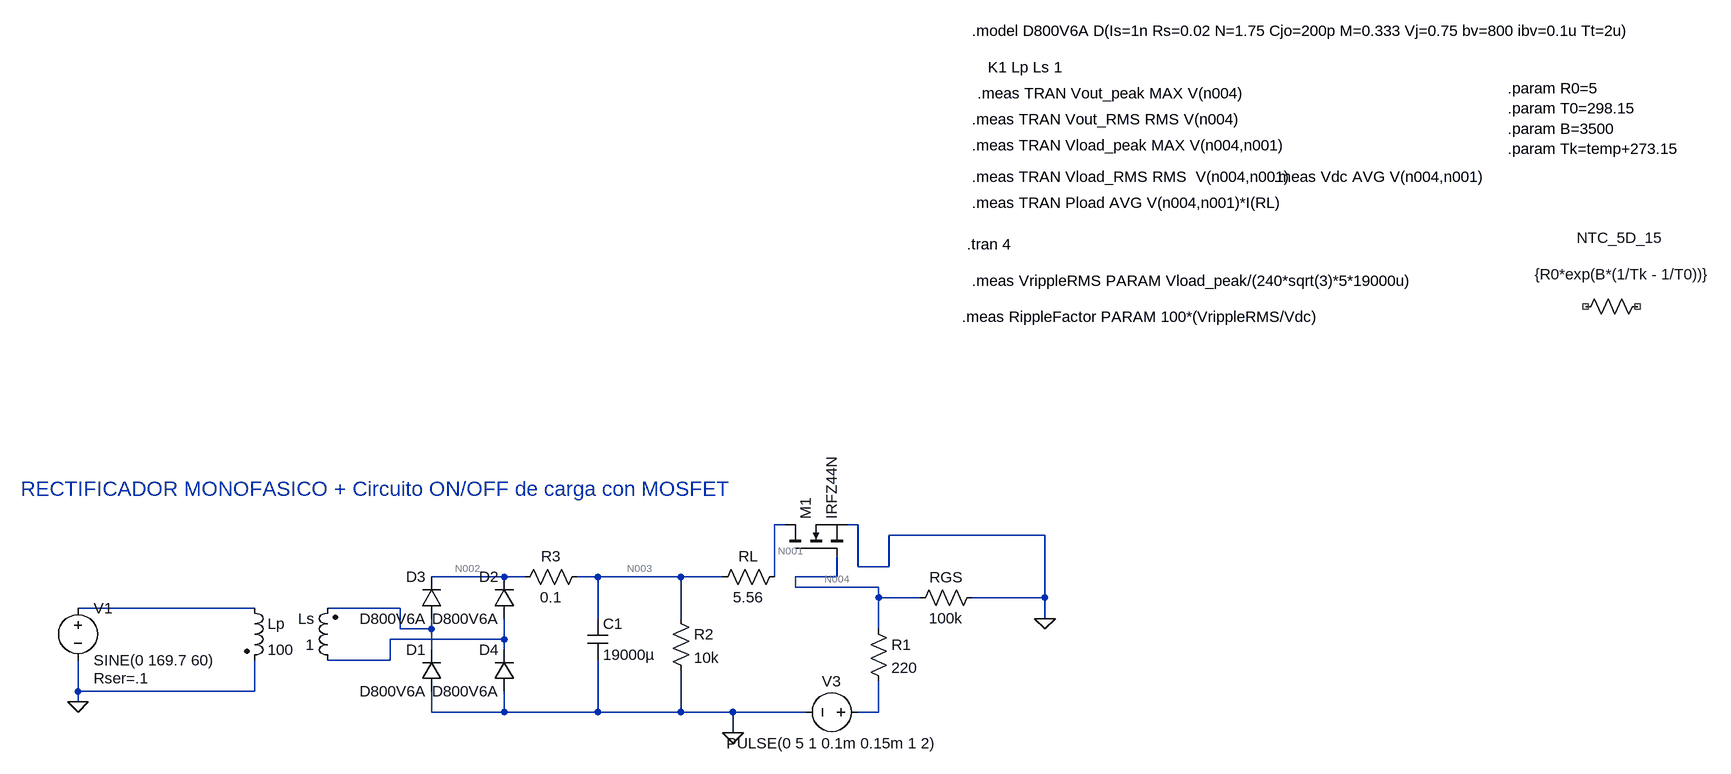
[diagram p0: schematic MOSFET Simulation.asc]
MOSFET Simulation.asc, the LTspice schematic file:
Version 4.1
SHEET 1 2096 824
WIRE 432 0 416 0
WIRE 544 0 528 0
WIRE 832 16 592 16
WIRE 544 64 544 0
WIRE 592 64 592 16
WIRE 592 64 544 64
WIRE 0 80 -112 80
WIRE 32 80 0 80
WIRE 144 80 112 80
WIRE 272 80 144 80
WIRE 336 80 272 80
WIRE 416 80 416 0
WIRE 512 80 512 48
WIRE 512 80 448 80
WIRE 448 96 448 80
WIRE 576 96 448 96
WIRE 576 112 576 96
WIRE 640 112 576 112
WIRE 832 112 832 16
WIRE 832 112 720 112
WIRE -384 128 -656 128
WIRE -160 128 -272 128
WIRE 144 144 144 80
WIRE 272 144 272 80
WIRE 832 144 832 112
WIRE -160 160 -160 128
WIRE -112 160 -112 144
WIRE -112 160 -160 160
WIRE 576 160 576 112
WIRE 0 176 0 144
WIRE 0 176 -176 176
WIRE -112 192 -112 160
WIRE 0 192 0 176
WIRE -176 208 -176 176
WIRE -176 208 -272 208
WIRE -656 256 -656 208
WIRE -384 256 -384 208
WIRE -384 256 -656 256
WIRE -656 272 -656 256
WIRE -112 288 -112 256
WIRE 0 288 0 256
WIRE 0 288 -112 288
WIRE 144 288 144 208
WIRE 144 288 0 288
WIRE 272 288 272 224
WIRE 272 288 144 288
WIRE 352 288 272 288
WIRE 464 288 352 288
WIRE 576 288 576 240
WIRE 576 288 544 288
WIRE 352 320 352 288
FLAG 352 320 0
FLAG -656 272 0
FLAG 832 144 0
SYMBOL diode -96 256 R180
WINDOW 0 24 64 Left 2
WINDOW 3 24 0 Left 2
SYMATTR InstName D1
SYMATTR Value D800V6A
SYMBOL diode 16 144 R180
WINDOW 0 24 64 Left 2
WINDOW 3 24 0 Left 2
SYMATTR InstName D2
SYMATTR Value D800V6A
SYMBOL diode -96 144 R180
WINDOW 0 24 64 Left 2
WINDOW 3 24 0 Left 2
SYMATTR InstName D3
SYMATTR Value D800V6A
SYMBOL diode 16 256 R180
WINDOW 0 24 64 Left 2
WINDOW 3 24 0 Left 2
SYMATTR InstName D4
SYMATTR Value D800V6A
SYMBOL voltage -656 112 R0
WINDOW 123 0 0 Left 0
WINDOW 39 24 124 Left 2
SYMATTR SpiceLine Rser=.1
SYMATTR InstName V1
SYMATTR Value SINE(0 169.7 60)
SYMBOL ind2 -400 112 R0
SYMATTR InstName Lp
SYMATTR Value 100
SYMBOL ind2 -256 224 R180
WINDOW 0 36 80 Left 2
WINDOW 3 36 40 Left 2
SYMATTR InstName Ls
SYMATTR Value 1
SYMBOL res 1760 -352 R90
WINDOW 0 -74 42 VBottom 2
WINDOW 3 -18 39 VBottom 2
SYMATTR InstName NTC_5D_15
SYMATTR Value {R0*exp(B*(1/Tk - 1/T0))}
SYMBOL res 256 128 R0
SYMATTR InstName R2
SYMATTR Value 10k
SYMBOL res 320 96 R270
WINDOW 0 32 56 VTop 2
WINDOW 3 0 56 VBottom 2
SYMATTR InstName RL
SYMATTR Value 5.56
SYMBOL voltage 560 288 R90
WINDOW 0 -32 56 VBottom 2
WINDOW 3 32 56 VTop 2
WINDOW 123 0 0 Left 0
WINDOW 39 0 0 Left 0
SYMATTR InstName V3
SYMATTR Value PULSE(0 5 1 0.1m 0.15m 1 2)
SYMBOL res 736 96 R90
WINDOW 0 0 56 VBottom 2
WINDOW 3 32 56 VTop 2
SYMATTR InstName RGS
SYMATTR Value 100k
SYMBOL res 560 144 R0
SYMATTR InstName R1
SYMATTR Value 220
SYMBOL nmos 432 48 R270
SYMATTR InstName M1
SYMATTR Value IRFZ44N
SYMBOL res 128 64 R90
WINDOW 0 0 56 VBottom 2
WINDOW 3 32 56 VTop 2
SYMATTR InstName R3
SYMATTR Value 0.1
SYMBOL cap 128 144 R0
SYMATTR Value 19000µ
SYMATTR InstName C1
SYMATTR SpiceLine V=16 Irms=1.39 Rser=0.044 Lser=0
TEXT 712 -432 Left 2 !.tran 4
TEXT -744 -56 Left 3 ;RECTIFICADOR MONOFASICO + Circuito ON/OFF de carga con MOSFET
TEXT 720 -760 Left 2 !.model D800V6A D(Is=1n Rs=0.02 N=1.75 Cjo=200p M=0.333 Vj=0.75 bv=800 ibv=0.1u Tt=2u)
TEXT 744 -704 Left 2 !K1 Lp Ls 1
TEXT 728 -664 Left 2 !.meas TRAN Vout_peak MAX V(n004)
TEXT 720 -624 Left 2 !.meas TRAN Vout_RMS RMS V(n004)
TEXT 720 -584 Left 2 !.meas TRAN Vload_peak MAX V(n004,n001)
TEXT 720 -536 Left 2 !.meas TRAN Vload_RMS RMS  V(n004,n001)
TEXT 720 -496 Left 2 !.meas TRAN Pload AVG V(n004,n001)*I(RL)
TEXT 1184 -536 Left 2 !.meas Vdc AVG V(n004,n001)
TEXT 720 -376 Left 2 !.meas VrippleRMS PARAM Vload_peak/(240*sqrt(3)*5*19000u)
TEXT 704 -320 Left 2 !.meas RippleFactor PARAM 100*(VrippleRMS/Vdc)
TEXT 1544 -672 Left 2 !.param R0=5\n.param T0=298.15\n.param B=3500\n.param Tk=temp+273.15

The netlist it stands for:
* MOSFET Simulation.asc
D1 0 N006 D800V6A
D2 N007 N002 D800V6A
D3 N006 N002 D800V6A
D4 0 N007 D800V6A
V1 N005 0 SINE(0 169.7 60) Rser=.1
Lp N005 0 100
Ls N007 N006 1
R§NTC_5D_15 NC_01 NC_02 {R0*exp(B*(1/Tk - 1/T0))}
R2 N003 0 10k
RL N003 N001 5.56
V3 N008 0 PULSE(0 5 1 0.1m 0.15m 1 2)
RGS 0 N004 100k
R1 N004 N008 220
M1 N001 N004 0 0 IRFZ44N
R3 N003 N002 0.1
C1 N003 0 19000µ V=16 Irms=1.39 Rser=0.044 Lser=0
.model D D
.lib standard.dio
.model NMOS NMOS
.model PMOS PMOS
.lib standard.mos
.tran 4
* RECTIFICADOR MONOFASICO + Circuito ON/OFF de carga con MOSFET
.model D800V6A D(Is=1n Rs=0.02 N=1.75 Cjo=200p M=0.333 Vj=0.75 bv=800 ibv=0.1u Tt=2u)
K1 Lp Ls 1
.meas TRAN Vout_peak MAX V(n004)
.meas TRAN Vout_RMS RMS V(n004)
.meas TRAN Vload_peak MAX V(n004,n001)
.meas TRAN Vload_RMS RMS  V(n004,n001)
.meas TRAN Pload AVG V(n004,n001)*I(RL)
.meas Vdc AVG V(n004,n001)
.meas VrippleRMS PARAM Vload_peak/(240*sqrt(3)*5*19000u)
.meas RippleFactor PARAM 100*(VrippleRMS/Vdc)
.param R0=5
.param T0=298.15
.param B=3500
.param Tk=temp+273.15
.backanno
.end

* Results of the author's LTspice run, read from the files saved beside the schematic
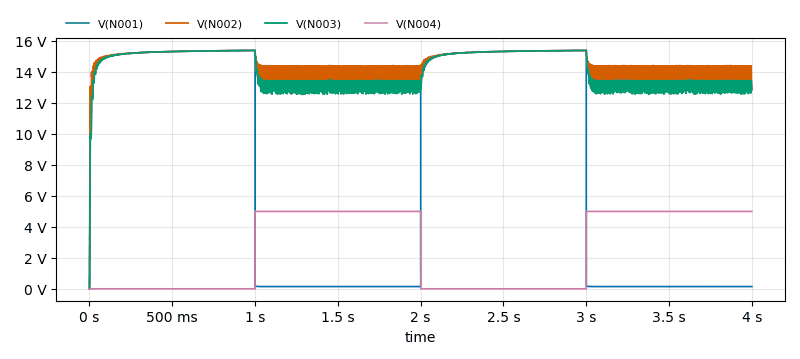
[diagram p1: Transient Analysis of MOSFET Simulation.asc, plotted from the saved traces]
* Transient Analysis, 1 run:
*   V(N001): min 0 V, max 15.37 V, average 7.648 V, rms 10.73 V, last 141.6 mV
*   V(N002): min 0 V, max 15.37 V, average 14.2 V, rms 14.25 V, last 12.85 V
*   V(N003): min 0 V, max 15.37 V, average 14.08 V, rms 14.13 V, last 12.85 V
*   V(N004): min -14.26 µV, max 4.989 V, average 2.495 V, rms 3.528 V, last 4.989 V
* From the log:
*   vout_peak: MAX(V(n004))=4.98904132843 FROM 0 TO 4
*   vout_rms: RMS(V(n004))=3.52778579655 FROM 0 TO 4
*   vload_peak: MAX(V(n004,n001))=4.85114616156 FROM 0 TO 4
*   vload_rms: RMS(V(n004,n001))=11.2599308334 FROM 0 TO 4
*   pload: AVG(V(n004,n001)*I(RL))=5.60344345647 FROM 0 TO 4
*   vdc: AVG(V(n004,n001))=-5.15352422002 FROM 0 TO 4
*   vripplerms: Vload_peak/(240*sqrt(3)*5*19000u)=0.122842567643
*   ripplefactor: 100*(VrippleRMS/Vdc)=-2.38366140137